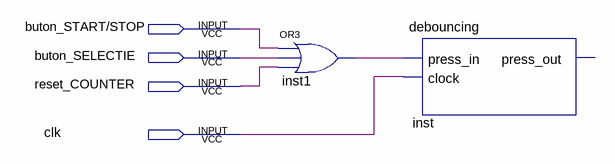
[diagram p0: schematic sheet]
// Quartus schematic sistem_debouncing.bdf as structural Verilog: 2 symbols, 4 pins
module sistem_debouncing (
  input  \buton_START/STOP ,
  input  buton_SELECTIE,
  input  reset_COUNTER,
  input  clk
);

  wire inst1_out;

  or inst1 (inst1_out, \buton_START/STOP , buton_SELECTIE, reset_COUNTER);
  debouncing inst (.press_in(inst1_out), .clock(clk));  // open: press_out
endmodule
